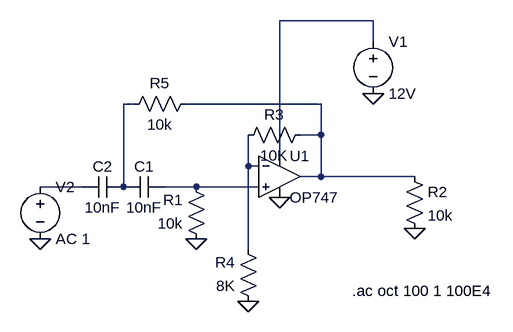
[diagram p0: schematic 2021-02-24-opamp-passa-alto-2ordine-amplificato.asc]
2021-02-24-opamp-passa-alto-2ordine-amplificato.asc, the LTspice schematic file:
Version 4
SHEET 1 880 680
WIRE 480 64 336 64
WIRE 480 96 480 64
WIRE 112 192 96 192
WIRE 400 192 192 192
WIRE 400 240 400 192
WIRE 400 240 368 240
WIRE 336 272 336 64
WIRE 288 288 288 240
WIRE 304 288 288 288
WIRE 400 304 400 240
WIRE 400 304 368 304
WIRE 544 304 400 304
WIRE 32 320 -32 320
WIRE 96 320 96 192
WIRE 208 320 160 320
WIRE 304 320 208 320
WIRE 288 416 288 288
FLAG -32 400 0
FLAG 208 400 0
FLAG 336 336 0
FLAG 480 176 0
FLAG 544 384 0
FLAG 288 496 0
SYMBOL Opamps/OP747 336 240 R0
SYMATTR InstName U1
SYMBOL res 224 416 R180
WINDOW 0 36 76 Left 2
WINDOW 3 36 40 Left 2
SYMATTR InstName R1
SYMATTR Value 10k
SYMBOL cap 160 304 R90
WINDOW 0 0 32 VBottom 2
WINDOW 3 32 32 VTop 2
SYMATTR InstName C1
SYMATTR Value 10nF
SYMBOL voltage 480 80 R0
SYMATTR InstName V1
SYMATTR Value 12V
SYMBOL res 528 288 R0
SYMATTR InstName R2
SYMATTR Value 10k
SYMBOL voltage -32 304 R0
SYMATTR InstName V2
SYMATTR Value AC 1
SYMBOL res 384 224 R90
WINDOW 0 0 56 VBottom 2
WINDOW 3 32 56 VTop 2
SYMATTR InstName R3
SYMATTR Value 10K
SYMBOL res 304 512 R180
WINDOW 0 36 76 Left 2
WINDOW 3 36 40 Left 2
SYMATTR InstName R4
SYMATTR Value 8K
SYMBOL res 208 176 R90
WINDOW 0 0 56 VBottom 2
WINDOW 3 32 56 VTop 2
SYMATTR InstName R5
SYMATTR Value 10k
SYMBOL cap 96 304 R90
WINDOW 0 0 32 VBottom 2
WINDOW 3 32 32 VTop 2
SYMATTR InstName C2
SYMATTR Value 10nF
TEXT 448 480 Left 2 !.ac oct 100 1 100E4

The netlist it stands for:
* 2021-02-24-opamp-passa-alto-2ordine-amplificato.asc
XU1 N006 N004 N001 0 N003 OP747  ; pins In+ In- V+ V- OUT
R1 0 N006 10k
C1 N006 N002 10nF
V1 N001 0 12V
R2 N003 0 10k
V2 N005 0 AC 1
R3 N003 N004 10K
R4 0 N004 8K
R5 N003 N002 10k
C2 N002 N005 10nF
.ac oct 100 1 100E4
.backanno
.end